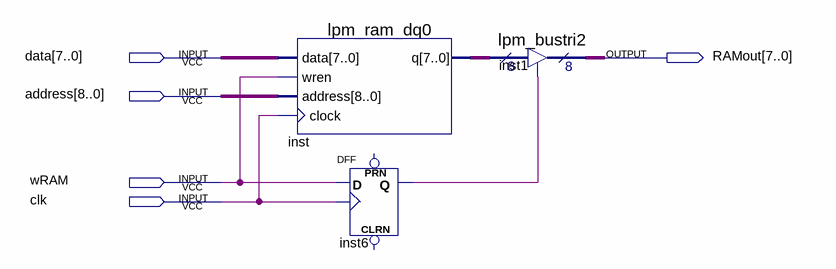
[diagram p0: schematic sheet]
// Quartus schematic RAM.bdf as structural Verilog: 3 symbols, 5 pins
module RAM (
  input  [7:0] data,
  input  [8:0] address,
  input  wRAM,
  input  clk,
  output [7:0] RAMout
);

  wire inst6_q;
  wire [7:0] inst_q;

  lpm_ram_dq0 inst (.data(data), .wren(wRAM), .address(address), .clock(clk), .q(inst_q));
  DFF inst6 (.CLK(clk), .D(wRAM), .Q(inst6_q));  // open: CLRN, PRN
  lpm_bustri2 inst1 (.enabledt(inst6_q), .data(inst_q), .tridata(RAMout));
endmodule
